# EAGLE board stm v0.3a (EAGLE 9.4.2)
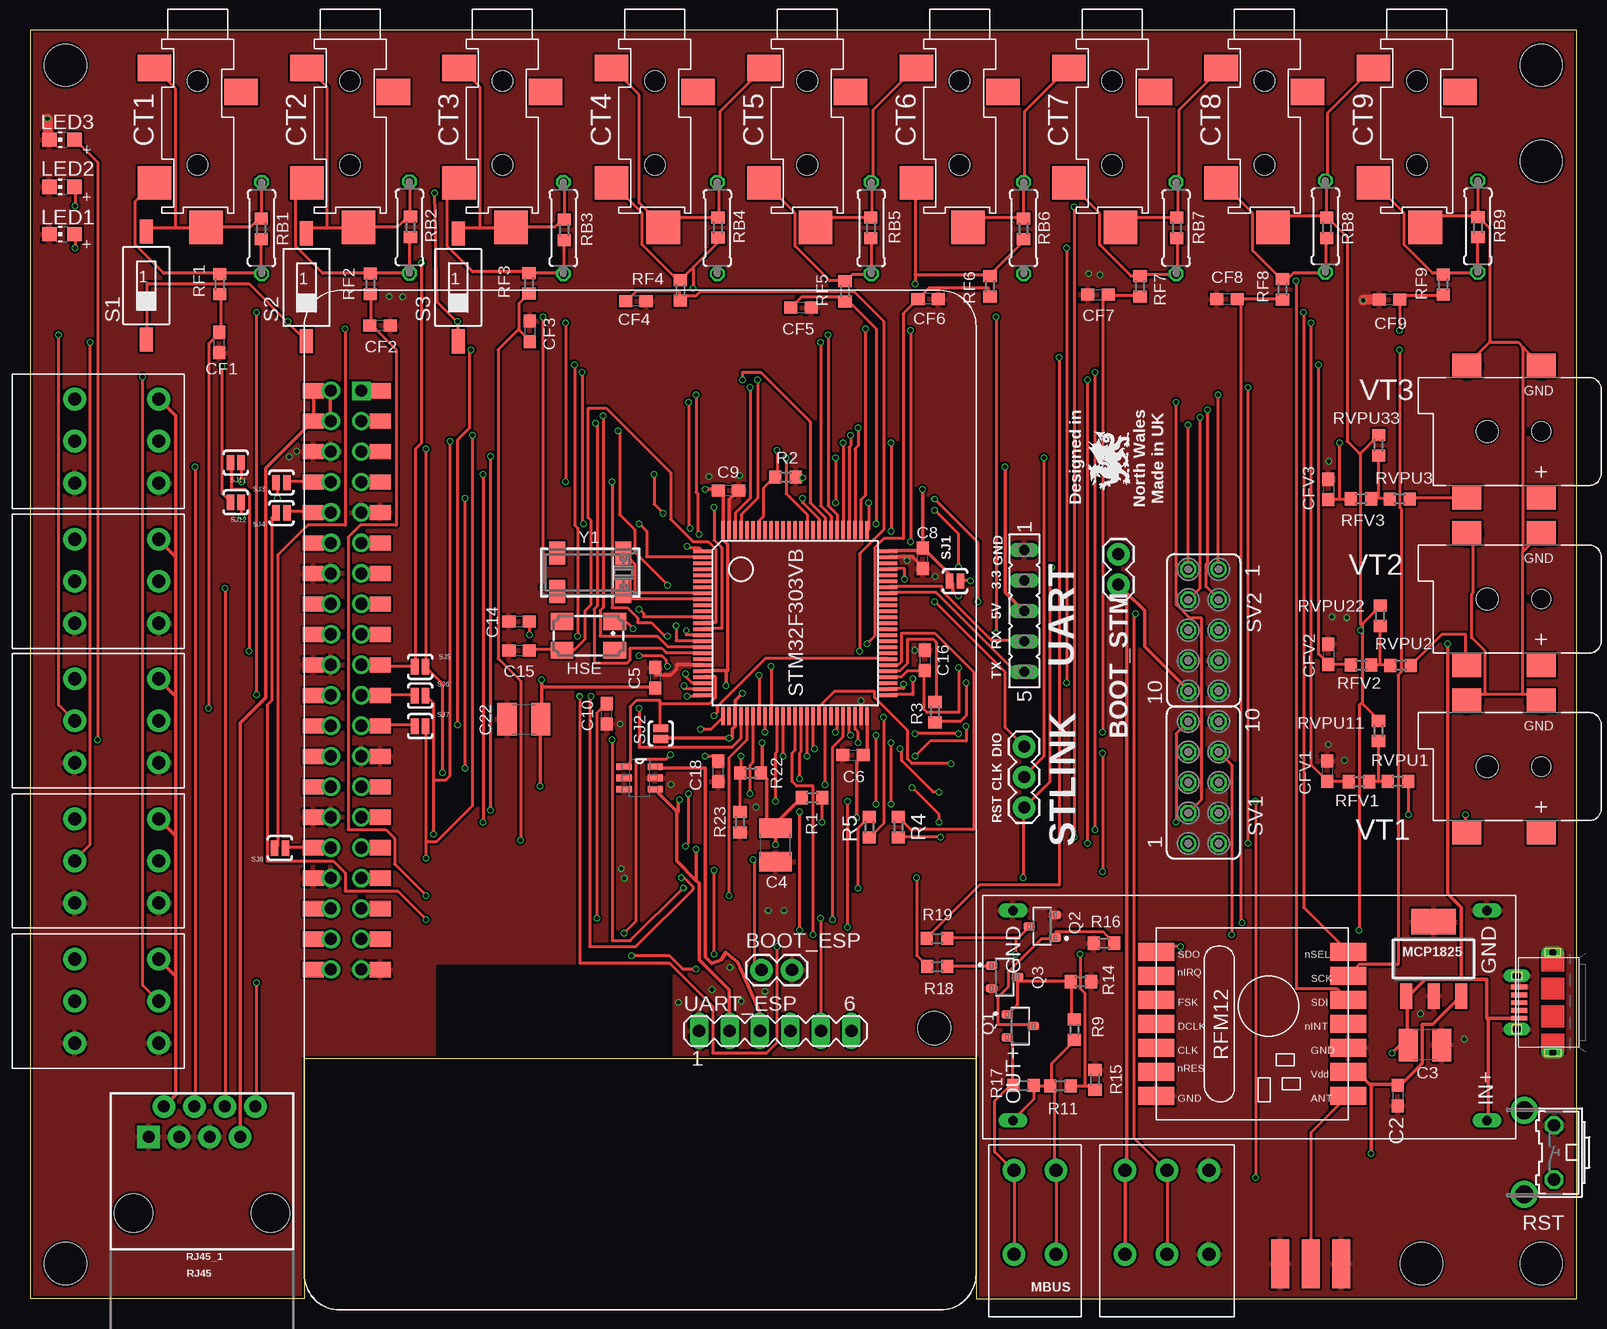
[diagram p2: board, top side]
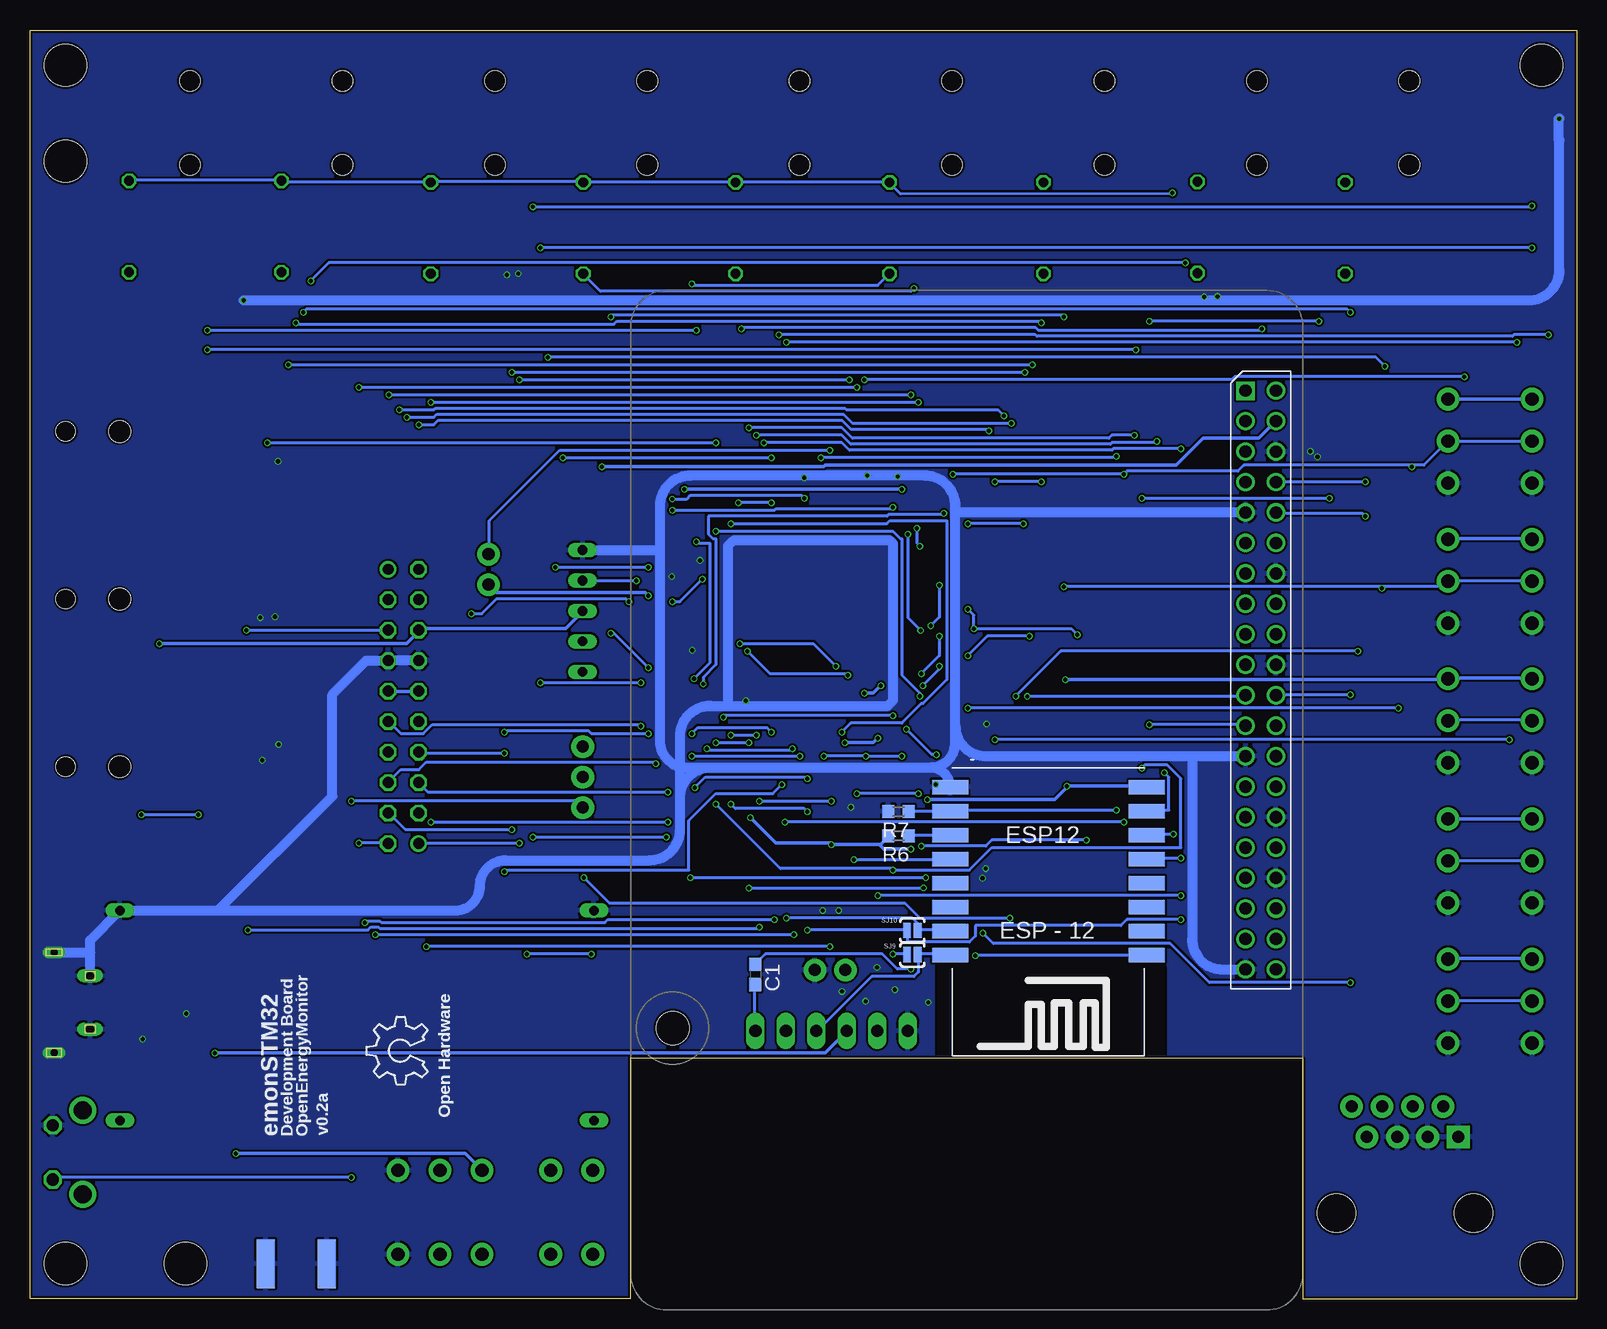
[diagram p3: board, bottom side, seen from below]

Size 128.91 x 105.79 mm. Coordinates in mm from the lower left corner, seen from the top.
Outline: 128.91,105.79 0,105.79 0,0 22.86,0 22.86,20.07 78.87,20.07 78.87,0 128.91,0 128.91,105.79
Copper layers (1*16): Top 0.035mm / dielectric 1.53mm / Bottom 0.035mm
Design rules "jlcpcb *": minimum track width 6mil, minimum drill 0.35mm, track to track 6mil, track to pad 6mil, pad to pad 7mil, via to via 8mil, smd to smd 0mil, copper to edge 8mil, drill to drill 10mil, minimum pad ring 3mil, minimum via ring 3mil, stop-mask expansion 2mil, vias tented up to drill 25mil, thermal gap 8mil
Net classes: 0 default: width 0.203 mm, drill 0.35 mm, clearance 0.152 mm; 1 power: width 0.279 mm, drill 0.35 mm, clearance 0.178 mm; 2 gnd: width 0.254 mm, drill 0.35 mm, clearance 0.152 mm
Holes 3.5 mm at 125.95,102.85 2.95,102.85 2.95,2.95 125.95,2.95 125.95,94.85 115.95,2.95
tRestrict: area 34,19.3 to 53.3,27.7
bRestrict: area 34.2,19.3 to 53.5,27.7

## Footprints (pad centres in the part's own frame; a part is rotated, then mirrored left to right if it is on the bottom)
OMNIMATE_LSF_2 = drill 1.1 pad 1.9: P$1 -3.5,-3.5; P$2 -3.5,3.5; P$3 0,-3.5; P$4 0,3.5
OMNIMATE_LSF_3 = drill 1.1 pad 1.9: P$1 -3.5,-3.5; P$2 -3.5,3.5; P$3 0,-3.5; P$4 0,3.5; P$5 3.5,-3.5; P$6 3.5,3.5
1X02 = drill 1.016 pad 1.88: 1 0,0; 2 2.54,0
C0603 = smd 1.1 x 1: 1 -0.85,0; 2 0.85,0
C1210 = smd 1.6 x 2.7: 1 -1.4,0; 2 1.4,0
STEREO_SMT = smd 2.8 x 2.2: P$1 -3.6,-2.4; P$3 3.6,-4.4 | smd 2.8 x 2.8: P$2 -3.6,-12; P$4 0.7,-15.7 | hole 1.7: 0,-3.5; 0,-10.5
ESP12-SMD = smd 3 x 1.2: ADC -8.3,3.8; CH_PD -8.3,1.8; GND 8.1,-8.2; GPIO0 8.1,-2.2; GPIO2 8.1,-4.2; GPIO4 8.1,-0.2; GPIO5 8.1,1.8; GPIO12 -8.3,-4.2; GPIO13 -8.3,-6.2; GPIO14 -8.3,-2.2; GPIO15 8.1,-6.2; GPIO16 -8.3,-0.2; RESET -8.3,5.8; RXD0 8.1,3.8; TXD0 8.1,5.8; VCC -8.3,-8.2
FE05-1 = drill 0.813 long: 1 -5.08,0; 2 -2.54,0; 3 0,0; 4 2.54,0; 5 5.08,0
CTS406 = smd 1.9 x 1.4: 1 -2.2,-1.2; 2 2.2,-1.2; 3 2.2,1.2; 4 -2.2,1.2
SMA-EDGE = smd 1.524 x 4.064: GND@0 0,0; GND@1 5.08,0; SIG 2.54,0 | smd 1.524 x 4.064 bottom: GND@2 0,0; GND@3 5.08,0
CHIP-LED0805 = smd 1.2 x 1.2: A 0,-1.05; C 0,1.05
SOT-223 = smd 1 x 2.1: 1 -2.3,-3.1; 2 0,-3.1; 3 2.3,-3.1 | smd 3.7 x 2.1: 4 0,3.1
RPI3MIRROR2 = drill 1.016 square: P$1 8.37,4.775 | drill 1.016: P$2 8.357,2.233; P$3 10.897,4.773; P$4 10.897,2.233; P$5 13.437,4.773; P$6 13.437,2.233; P$7 15.977,4.773; P$8 15.977,2.233; P$9 18.517,4.773; P$10 18.517,2.233; P$11 21.057,4.773; P$12 21.057,2.233; P$13 23.597,4.773; P$14 23.597,2.233; P$15 26.137,4.773; P$16 26.137,2.233; P$17 28.677,4.773; P$18 28.677,2.233; P$19 31.217,4.773; P$20 31.217,2.233; P$21 33.757,4.773; P$22 33.757,2.233; P$23 36.297,4.773; P$24 36.297,2.233; P$25 38.837,4.773; P$26 38.837,2.233; P$27 41.377,4.773; P$28 41.377,2.233; P$29 43.917,4.773; P$30 43.917,2.233; P$31 46.457,4.773; P$32 46.457,2.233; P$33 48.997,4.773; P$34 48.997,2.233; P$35 51.537,4.773; P$36 51.537,2.233; P$37 54.077,4.773; P$38 54.077,2.233; P$39 56.617,4.773; P$40 56.617,2.233 | smd 1.27 x 1.778: P$41 8.371,6.351; P$42 8.371,0.763; P$43 10.911,6.351; P$44 10.911,0.763; P$45 13.451,6.351; P$46 13.451,0.763; P$47 15.991,6.351; P$48 15.991,0.763; P$49 18.531,6.351; P$50 18.531,0.763; P$51 21.071,6.351; P$52 21.071,0.763; P$53 23.611,6.351; P$54 23.611,0.763; P$55 26.151,6.351; P$56 26.151,0.763; P$57 28.691,6.351; P$58 28.691,0.763; P$59 31.231,6.351; P$60 31.231,0.763; P$61 33.771,6.351; P$62 33.771,0.763; P$63 36.311,6.351; P$64 36.311,0.763; P$65 38.851,6.351; P$66 38.851,0.763; P$67 41.391,6.351; P$68 41.391,0.763; P$69 43.931,6.351; P$70 43.931,0.763; P$71 46.471,6.351; P$72 46.471,0.763; P$73 49.011,6.351; P$74 49.011,0.763; P$75 51.551,6.351; P$76 51.551,0.763; P$77 54.091,6.351; P$78 54.091,0.763; P$79 56.631,6.351; P$80 56.631,0.763 | hole 2.75: 61.5,52.505
SOT23 = smd 0.71 x 0.96: 1 -0.95,-1.075; 2 0.95,-1.075; 3 0,1.075
R0603 = smd 1 x 1.1: 1 -0.85,0; 2 0.85,0
0207/7 = drill 0.813 octagon: 1 -3.81,0; 2 3.81,0
RFM12 = smd 1.5 x 3: 1 -5,-10; 2 -3,-10; 3 -1,-10; 4 1,-10; 5 3,-10; 6 5,-10; 7 7,-10; 8 7,6; 9 5,6; 10 3,6; 11 1,6; 12 -1,6; 13 -3,6; 14 -5,6
RJ45-8 = drill 1 pad 1.88 square: 1 -4.445,6.35 | drill 1 pad 1.88: 2 -3.175,8.89; 3 -1.905,6.35; 4 -0.635,8.89; 5 0.635,6.35; 6 1.905,8.89; 7 3.175,6.35; 8 4.445,8.89 | hole 3.2: -5.715,0; 5.715,0
B3F-31XX = drill 1.016 octagon: 1 -2.261,-1.245; 2 2.261,-1.245 | drill 1.499 pad 2.159: 3 -3.505,1.245; 4 3.505,1.245
SMS-001 = smd 1.092 x 2.007: 1 0,-4.496; 2 0,4.496
SJ_2S-NO = smd 0.635 x 1.27: 1 -0.45,0; 2 0.45,0
1X03 = drill 1.016 pad 1.88: 1 0,0; 2 2.54,0; 3 5.08,0
TQFP100 = smd 0.27 x 1.5: 1 -6,-7.75; 2 -5.5,-7.75; 3 -5,-7.75; 4 -4.5,-7.75; 5 -4,-7.75; 6 -3.5,-7.75; 7 -3,-7.75; 8 -2.5,-7.75; 9 -2,-7.75; 10 -1.5,-7.75; 11 -1,-7.75; 12 -0.5,-7.75; 13 0,-7.75; 14 0.5,-7.75; 15 1,-7.75; 16 1.5,-7.75; 17 2,-7.75; 18 2.5,-7.75; 19 3,-7.75; 20 3.5,-7.75; 21 4,-7.75; 22 4.5,-7.75; 23 5,-7.75; 24 5.5,-7.75; 25 6,-7.75; 51 6,7.75; 52 5.5,7.75; 53 5,7.75; 54 4.5,7.75; 55 4,7.75; 56 3.5,7.75; 57 3,7.75; 58 2.5,7.75; 59 2,7.75; 60 1.5,7.75; 61 1,7.75; 62 0.5,7.75; 63 0,7.75; 64 -0.5,7.75; 65 -1,7.75; 66 -1.5,7.75; 67 -2,7.75; 68 -2.5,7.75; 69 -3,7.75; 70 -3.5,7.75; 71 -4,7.75; 72 -4.5,7.75; 73 -5,7.75; 74 -5.5,7.75; 75 -6,7.75 | smd 1.5 x 0.27: 26 7.75,-6; 27 7.75,-5.5; 28 7.75,-5; 29 7.75,-4.5; 30 7.75,-4; 31 7.75,-3.5; 32 7.75,-3; 33 7.75,-2.5; 34 7.75,-2; 35 7.75,-1.5; 36 7.75,-1; 37 7.75,-0.5; 38 7.75,0; 39 7.75,0.5; 40 7.75,1; 41 7.75,1.5; 42 7.75,2; 43 7.75,2.5; 44 7.75,3; 45 7.75,3.5; 46 7.75,4; 47 7.75,4.5; 48 7.75,5; 49 7.75,5.5; 50 7.75,6; 76 -7.75,6; 77 -7.75,5.5; 78 -7.75,5; 79 -7.75,4.5; 80 -7.75,4; 81 -7.75,3.5; 82 -7.75,3; 83 -7.75,2.5; 84 -7.75,2; 85 -7.75,1.5; 86 -7.75,1; 87 -7.75,0.5; 88 -7.75,0; 89 -7.75,-0.5; 90 -7.75,-1; 91 -7.75,-1.5; 92 -7.75,-2; 93 -7.75,-2.5; 94 -7.75,-3; 95 -7.75,-3.5; 96 -7.75,-4; 97 -7.75,-4.5; 98 -7.75,-5; 99 -7.75,-5.5; 100 -7.75,-6
FE05-2 = drill 0.914: 1 -5.08,1.27 | drill 0.914 octagon: 2 -5.08,-1.27; 3 -2.54,1.27; 4 -2.54,-1.27; 5 0,1.27; 6 0,-1.27; 7 2.54,1.27; 8 2.54,-1.27; 9 5.08,1.27; 10 5.08,-1.27
47589-0001 = smd 1.35 x 0.4: 1 2.8,1.3; 2 2.8,0.65; 3 2.8,0; 4 2.8,-0.65; 5 2.8,-1.3 | drill 0.6 pad 0.95 long: CASING1 0,4.175; CASING2 0,-4.175 | drill 0.7 pad 1.1 long: CASING3 3,2.225; CASING4 3,-2.225
BOOST = drill 0.8 long: IN+ 17.5,39.5; OUT+ 17.5,0; P$1 0,0; P$2 0,39.5
SOT95P280X145-6N = smd 1.27 x 0.559: 1 -1.295,0.94; 2 -1.295,0; 3 -1.295,-0.94; 4 1.295,-0.94; 5 1.295,0; 6 1.295,0.94
MA06-1 = drill 1.016 long: 1 -6.35,0; 2 -3.81,0; 3 -1.27,0; 4 1.27,0; 5 3.81,0; 6 6.35,0
DCJACK_2MM_SMT = smd 2.4 x 2: GND 0,-5.5; GNDBREAK 6.2,-5.5; PWR1 0,5.5; PWR2 6.2,5.5 | hole 1.6: 0,0 | hole 1.8: 4.5,0
CRYSTAL_8X3.8 = smd 1.3 x 1.9: P$1 -2.75,-1.6; P$2 2.75,-1.6; P$3 2.75,1.6; P$4 -2.75,1.6

## Placement (x,y rotation side)
2POLE_MBUS  OMNIMATE_LSF_2  [OMNIMATE_LSF_2]  85.5,7.24 0 top
3POLE_1  OMNIMATE_LSF_3  [OMNIMATE_LSF_3]  7.23,71.51 270 top
3POLE_2  OMNIMATE_LSF_3  [OMNIMATE_LSF_3]  7.23,59.83 270 top
3POLE_3  OMNIMATE_LSF_3  [OMNIMATE_LSF_3]  7.23,48.2 270 top
3POLE_4  OMNIMATE_LSF_3  [OMNIMATE_LSF_3]  7.23,36.52 270 top
3POLE_5  OMNIMATE_LSF_3  [OMNIMATE_LSF_3]  7.23,24.83 270 top
3POLE_6  OMNIMATE_LSF_3  [OMNIMATE_LSF_3]  94.74,7.24 0 top
BOOT_ESP  [1X02]  60.96,27.43 0 top
BOOT_STM  [1X02]  90.7,62.09 270 top
C1  100nF  [C0603]  68.45,27.05 270 bottom
C2  100nF  [C0603]  113.97,16.96 270 top
C3  4.7uF  [C1210]  116.25,21.17 180 top
C4  4.7uF  [C1210]  62.13,37.85 90 top
C5  100nF  [C0603]  52.09,51.79 270 top
C6  100nF  [C0603]  68.59,45.34 0 top
C8  100nF  [C0603]  74.39,61.75 90 top
C9  100nF  [C0603]  58.2,67.38 180 top
C10  100nF  [C0603]  48.08,48.78 90 top
C14  18pF  [C0603]  40.76,56.47 180 top
C15  18pF  [C0603]  40.76,54.04 180 top
C16  100nF  [C0603]  74.58,53.24 270 top
C18  10uF  [C0603]  57.36,43.98 90 top
C22  1uF  [C1210]  41.15,48.34 0 top
CF1  100nF  [C0603]  15.79,79.74 90 top
CF2  100nF  [C0603]  29.17,81.16 180 top
CF3  100nF  [C0603]  41.63,80.66 270 top
CF4  100nF  [C0603]  50.49,83.19 180 top
CF5  100nF  [C0603]  64.25,82.64 180 top
CF6  100nF  [C0603]  74.84,83.37 180 top
CF7  100nF  [C0603]  89,83.73 0 top
CF8  100nF  [C0603]  99.74,83.37 0 top
CF9  100nF  [C0603]  113.3,83.33 0 top
CFV1  100nF  [C0603]  108.1,44 270 top
CFV2  100nF  [C0603]  108.2,53.74 270 top
CFV3  100nF  [C0603]  108.2,67.49 270 top
CT1  STEREO_SMD  [STEREO_SMT]  13.97,105.04 0 top
CT2  STEREO_SMD  [STEREO_SMT]  26.67,105.04 0 top
CT3  STEREO_SMD  [STEREO_SMT]  39.37,105.04 0 top
CT4  STEREO_SMD  [STEREO_SMT]  52.07,105.04 0 top
CT5  STEREO_SMD  [STEREO_SMT]  64.77,105.04 0 top
CT6  STEREO_SMD  [STEREO_SMT]  77.47,105.04 0 top
CT7  STEREO_SMD  [STEREO_SMT]  90.17,105.04 0 top
CT8  STEREO_SMD  [STEREO_SMT]  102.87,105.04 0 top
CT9  STEREO_SMD  [STEREO_SMT]  115.57,105.04 0 top
ESP12  [ESP12-SMD]  44.13,34.47 180 bottom
GND  UART  [FE05-1]  82.86,57.36 270 top
HSE  8MHZ  [CTS406]  46.54,55.29 180 top
J$1  SMA_EDGE  [SMA-EDGE]  104.18,2.93 0 top
LED1  Red 1.85V  [CHIP-LED0805]  2.67,88.77 90 top
LED2  Red 1.85V  [CHIP-LED0805]  2.67,92.71 90 top
LED3  Red 1.85V  [CHIP-LED0805]  2.67,96.65 90 top
LOGO1  OSHW_LOGO_6MILX0200-NT  [OSHW_6X200_NOTEXT]  95.78,17.86 90 bottom
MCP1825  MCP1825SOT-223-3  [SOT-223]  116.97,28.35 0 top
PCB2  RPI3YA  [RPI3MIRROR2]  22.84,84.09 270 top
Q1  MMBT3906  [SOT23]  82.52,22.77 270 top
Q2  MMBT3904  [SOT23]  84.34,31.07 90 top
Q3  MMBT3904  [SOT23]  81.21,26.85 270 top
R1  4.7k  [R0603]  65.18,41.79 180 top
R2  10k  [R0603]  62.97,68.51 0 top
R3  220R  [R0603]  75.41,48.93 90 top
R4  220R  [R0603]  72.36,39.34 90 top
R5  220R  [R0603]  69.95,39.34 270 top
R6  10k  [R0603]  56.52,38.61 180 bottom
R7  10k  [R0603]  56.52,40.64 180 bottom
R9  39K  [R0603]  87.03,22.46 270 top
R11  33K  [R0603]  85.86,17.77 180 top
R14  22K  [R0603]  87.57,26.46 180 top
R15  3k3  [R0603]  88.75,18.27 270 top
R16  82R  [R0603]  89.51,29.66 0 top
R17  220K  [R0603]  82.79,17.81 0 top
R18  1K  [R0603]  75.6,27.72 180 top
R19  1K  [R0603]  75.6,30.06 180 top
R22  10k  [R0603]  60.06,43.85 0 top
R23  10k  [R0603]  59.16,39.76 90 top
RB1  22r  [R0603]  19.27,89.22 90 top
RB2  22r  [R0603]  31.71,89.37 90 top
RB3  22r  [R0603]  44.52,89.12 90 top
RB4  22r  [R0603]  57.33,89.31 90 top
RB5  22r  [R0603]  70.07,89.29 90 top
RB6  22r  [R0603]  82.78,89.22 90 top
RB7  22r  [R0603]  95.56,89.3 90 top
RB8  22r  [R0603]  108.07,89.31 90 top
RB9  22r  [R0603]  120.67,89.36 90 top
RB10  22r  [0207/7]  19.3,89.28 90 top
RB11  22r  [0207/7]  31.62,89.33 90 top
RB12  22r  [0207/7]  44.45,89.28 90 top
RB13  22r  [0207/7]  57.28,89.28 90 top
RB14  22r  [0207/7]  70.1,89.28 90 top
RB15  22r  [0207/7]  82.8,89.28 90 top
RB16  22r  [0207/7]  95.5,89.28 90 top
RB17  22r  [0207/7]  107.95,89.41 90 top
RB18  22r  [0207/7]  120.65,89.41 90 top
RF1  330R  [R0603]  15.81,84.6 270 top
RF2  330R  [R0603]  28.36,84.62 270 top
RF3  330R  [R0603]  41.59,84.66 270 top
RF4  330R  [R0603]  54.2,84.09 270 top
RF5  330R  [R0603]  67.92,84.01 270 top
RF6  330R  [R0603]  80,84.41 270 top
RF7  330R  [R0603]  92.5,84.43 270 top
RF8  330R  [R0603]  104.38,84.16 270 top
RF9  330R  [R0603]  117.77,84.56 270 top
RFM69HCW  RFM12_SMDSMD  [RFM12]  103.86,23.92 270 top
RFV1  330R  [R0603]  110.75,43.13 180 top
RFV2  330R  [R0603]  110.93,52.85 180 top
RFV3  330R  [R0603]  110.92,66.72 180 top
RJ45_1  RJ45  [RJ45-8]  14.33,7.17 0 top
RST  [B3F-31XX]  125.76,12.21 90 top
RVPU1  120k  [R0603]  114,43.15 0 top
RVPU2  120k  [R0603]  114.22,52.82 0 top
RVPU3  120k  [R0603]  114.15,66.7 180 top
RVPU11  10k  [R0603]  112.38,47.36 90 top
RVPU22  10k  [R0603]  112.52,56.96 90 top
RVPU33  10k  [R0603]  112.39,71.18 90 top
S1  SWS001  [SMS-001]  9.69,84.49 180 top
S2  SWS001  [SMS-001]  23.04,84.34 180 top
S3  SWS001  [SMS-001]  35.69,84.33 180 top
SJ1  SOLDERJUMPERNO  [SJ_2S-NO]  77.09,59.85 180 top
SJ2  SOLDERJUMPERNO  [SJ_2S-NO]  52.56,47.13 90 top
SJ3  SOLDERJUMPERNO  [SJ_2S-NO]  20.95,68.07 180 top
SJ4  SOLDERJUMPERNO  [SJ_2S-NO]  20.95,65.53 180 top
SJ5  SOLDERJUMPERNO  [SJ_2S-NO]  32.51,52.7 180 top
SJ6  SOLDERJUMPERNO  [SJ_2S-NO]  32.51,50.29 180 top
SJ7  SOLDERJUMPERNO  [SJ_2S-NO]  32.51,47.75 180 top
SJ8  SOLDERJUMPERNO  [SJ_2S-NO]  20.83,37.59 180 top
SJ9  SOLDERJUMPERNO  [SJ_2S-NO]  55.37,28.7 0 bottom
SJ10  SOLDERJUMPERNO  [SJ_2S-NO]  55.37,30.73 180 bottom
SJ11  SOLDERJUMPERNO  [SJ_2S-NO]  17.14,69.72 180 top
SJ12  SOLDERJUMPERNO  [SJ_2S-NO]  17.14,66.42 180 top
STLINK  [1X03]  82.84,46.06 270 top
STM32F303VB  STM32F303XB  [TQFP100]  63.75,56.34 270 top
SV1  [FE05-2]  97.79,43.05 90 top
SV2  [FE05-2]  97.79,55.75 270 top
U$1  MICRO-USB-RECEPTACLE47589-0001  [47589-0001]  126.89,24.71 180 top
U$2  BOOST_MODULE  [BOOST]  81.92,32.38 270 top
U$8  MCP1501T-33E  [SOT95P280X145-6N]  50.8,43.43 0 top
UART_ESP  [MA06-1]  62.1,22.35 0 top
VT1  2.1MMJACKSMT  [DCJACK_2MM_SMT]  125.94,44.38 180 top
VT2  2.1MMJACKSMT  [DCJACK_2MM_SMT]  125.94,58.35 180 top
VT3  2.1MMJACKSMT  [DCJACK_2MM_SMT]  125.94,72.32 180 top
Y1  32.768kHz  [CRYSTAL_8X3.8]  46.69,60.58 180 top

## Tracks (layer width: path | path; a pad name or v marks a point on that pad's centre or on a via)
24V
  Top 0.254: R11.2 85,17.75 83.75,17.75 R17.2 83.62,17.75 83.62,16.62 82,15 U$2.OUT+ | R9.2 87,21.5 85.12,19.62 85.12,17.88 R11.2 | 2POLE_MBUS.P$3 85.5,10.62 2POLE_MBUS.P$4 85.38,10.75 85.38,17.75 85.25,17.88 R11.2
+3V3  (via drill 0.35)
  Top 0.279: 111.75,17.88 111.62,17.88 110.62,18.88 109.88,18.88 RFM69HCW.9 | 111.75,17.88 113.88,17.88 C2.1 114,17.88 114.25,17.88 116,19.62 116,22.88 116.88,22.88 119.25,25.25 MCP1825.3 | 3POLE_6.P$1 91.25,10.62 3POLE_6.P$2 91.38,10.75 91.38,58.75 91.44,58.81 | C8.2 74.5,62.5 76.62,60.38 76.62,59.88 SJ1.2 76.75,59.75 76.88,59.62 76.88,59 77.25,58.62 v77.38,58.62 | STM32F303VB.75 71.62,62.38 74.38,62.38 74.38,62.5 C8.2 | 91.44,58.81 90.75,59.5 BOOT_STM.2 | 91.44,58.81 92.88,57.38 92.88,54.38 96.5,50.75 SV2.10 | v111.75,12.12 111.75,17.88 | 12.12,26.88 12.12,17 11.25,16.12 RJ45_1.2 | 12.12,26.88 10.75,28.25 3POLE_5.P$2 | 12.06,38.69 12.12,38.62 12.12,26.88 | 12.06,38.69 10.75,40 3POLE_4.P$2 | 12.06,50.31 12.12,50.25 12.12,38.75 12.06,38.69 | 12.06,50.31 10.75,51.62 3POLE_3.P$2 | 12.06,61.94 12.12,61.88 12.12,50.38 12.06,50.31 | 12.06,61.94 10.75,63.25 3POLE_2.P$2 | 3POLE_1.P$2 10.75,75 12.12,73.62 12.12,62 12.06,61.94 | 58,52.38 58.12,52.38 58.12,62.88 57.75,63.25 57.75,64 STM32F303VB.100 57.75,64.12 57.75,67 57.38,67.38 C9.2 57.25,67.5 v56.25,67.5 | 58,52.38 56.12,52.38 STM32F303VB.21 | SJ2.1 52.62,46.75 v58.25,46.75 58.5,46.75 58.5,47.5 58.75,47.75 58.75,48.5 STM32F303VB.28 58.75,48.62 58.75,49.88 v59.38,50.5 | STM32F303VB.50 69.75,48.5 69.75,45.62 69.5,45.38 C6.2 69.38,45.25 68.88,44.75 v68.88,40.12 | v62.12,37.88 C4.2 | C4.2 62,39.25 61.38,39.88 61.38,43.38 61,43.75 R22.2 61,43.88 v61,46.38 | R1.2 64.25,41.75 62.25,39.75 62.25,39.38 C4.2 | v58,51.12 58,52.38 | 42.62,51 52,51 C5.2 | 42.62,51 42.62,48.38 C22.2 42.5,48.25 v42.5,42.75 | 53.88,40.62 52.12,42.38 U$8.4 | 53.88,40.62 53.88,36.5 55.44,34.94
  Top 0.279: 55.44,34.94 55.75,34.62 55.75,28.25 58.25,25.75 58.25,22.38 UART_ESP.2 | v54.12,41.62 54,41.5 54,40.62 53.88,40.62 | v55.5,37.5 55.5,35 55.44,34.94 | 42.62,51 v42.62,51.62 | v74.38,67.5 74.38,62.62 C8.2
  Bottom 0.279: SV2.10 96.62,50.62 99,50.62 SV2.9 | v77.38,58.62 77.62,58.88 90,58.88 90.62,59.5 BOOT_STM.2 | v111.75,12.12 92.62,12.12 3POLE_6.P$2 | 3POLE_1.P$1 3.75,75 10.62,75 3POLE_1.P$2 | 3POLE_2.P$1 3.75,63.38 10.62,63.38 3POLE_2.P$2 | 3POLE_3.P$1 3.75,51.75 10.62,51.75 3POLE_3.P$2 10.75,51.62 v42.62,51.62 | 3POLE_4.P$1 3.75,40 10.62,40 3POLE_4.P$2 | 3POLE_5.P$1 3.75,28.38 10.62,28.38 3POLE_5.P$2 | 58,37.88 57.38,38.5 R6.2 | 58,37.88 v62.12,37.88 62.12,38 66.75,38 v68.88,40.12 | v58.25,46.75 58.62,46.38 v61,46.38 | v58,51.12 58.62,50.5 v59.38,50.5 | ESP12.VCC 35.88,42.75 v42.5,42.75 42.5,42.62 43.5,41.62 v54.12,41.62 | v55.5,37.5 57.75,37.5 58,37.75 58,37.88 | v56.25,67.5 v74.38,67.5
+3V3_ADC
  Top 0.254: 52.5,49.62 52.5,47.62 SJ2.2 | 52.5,49.62 52.5,49.88 50.5,49.88 50,49.38 50,44.75 49.62,44.38 U$8.1 | 52.5,49.62 56.62,49.62 57.12,50.12 57.12,51.88 56.12,51.88 STM32F303VB.22
+5V  (via drill 0.35)
  Top 0.279: PCB2.P$4 25,73.25 25,75.5 PCB2.P$2 25,75.62 23.75,75.62 PCB2.P$42 23.62,75.62 23.62,73.25 PCB2.P$44 23.5,73.12 19.62,69.25 19.62,50.12 17.5,48 17.5,13.62 RJ45_1.7 | U$8.6 52.12,44.25 56.25,44.25 56.25,28.5 56.81,27.96 57.6,28.26 57.98,28.9 58.97,28.06 60.75,24 60.75,22.38 UART_ESP.3 | 121.5,23.38 124,23.38 U$1.1 | 121.5,23.38 121.5,15 U$2.IN+ | 119.25,26.62 121.38,26.62 121.38,23.38 121.5,23.38 | 119.25,26.62 116.25,26.62 114.88,25.25 MCP1825.1 114.75,25.25 114.75,21.25 C3.2 114.62,21.25 114.25,21.25 v113.5,20.5 | v118.12,54.62 118.12,33.75 119.25,32.62 119.25,26.62 | v81.25,69.38 81.25,58.88 82.75,57.38 GND.3
  Bottom 0.279: GND.3 82.88,57.25 84.25,55.88 96.5,55.88 SV2.6 96.5,55.62 97.5,54.62 v118.12,54.62 | v113.5,20.5 62.62,20.5 60.88,22.25 UART_ESP.3 | v81.25,69.38 62.75,69.38 62.62,69.5 33.38,69.5 31.12,71.75 26.5,71.75 25.12,73.12 PCB2.P$4
AC1  (via drill 0.35)
  Top 0.254: v114.88,40.38 114.88,43.12 RVPU1.2 | v119.62,40.38 119.62,39 VT1.PWR2
  Bottom 0.254: v119.62,40.38 v114.88,40.38
AC2
  Top 0.254: RVPU2.2 115.12,52.88 117.62,55.38 119.62,55.38 119.62,52.88 VT2.PWR2
AC3
  Top 0.254: RVPU3.1 115,66.75 119.62,66.75 VT3.PWR2
ADC0
  Top 0.254: 112.38,66.75 111.88,66.75 RFV3.1 | 112.38,66.75 113.25,66.75 RVPU3.2 | 112.38,66.75 112.38,70.25 RVPU33.1
ADC_RJ45IN  (via drill 0.35)
  Top 0.254: v55.88,47.5 56.75,47.5 57.75,48.5 STM32F303VB.26 | v53.38,45.38 53,45 50.5,45 50.5,31.5 v49.5,30.5 | v18.88,26.38 18.88,16.12 RJ45_1.8
  Bottom 0.254: v55.88,47.5 53.75,45.38 v53.38,45.38 | v49.5,30.5 48.62,29.62 33.88,29.62 30.62,26.38 v18.88,26.38
ANT
  Top 0.254: RFM69HCW.8 109.75,16.88 106.75,13.88 106.75,3 J$1.SIG
BIAS  (via drill 0.35)
  Top 0.254: 111,49.62 112.38,48.25 RVPU11.2 | 111,56.25 111,55.75 | 111,55.75 111,49.62 | 111,56.25 112.5,57.75 RVPU22.2 | 110.88,70.5 112.38,72 RVPU33.2 | 110.88,70.5 110.88,56.25 111,56.25 | v62.12,41.5 62.12,45.5 62.25,45.62 62.25,48.5 STM32F303VB.35 | v68.12,31 v68.12,41.5 | v110.75,30.75 110.75,49.5 110.88,49.62 111,49.62 | v110.88,55.75 111,55.75 | 124.38,50.38 125.88,50.38 125.88,50 VT1.GND | 124.38,50.38 121.25,50.38 | 121.25,50.38 120.12,50.38 119.75,50 VT1.GNDBREAK | 121.25,50.38 121.25,54 120.12,55.12 120.12,58.75 120.25,58.88 120.25,63.25 119.75,63.75 VT2.GNDBREAK | 124.44,62.31 124.38,62.25 124.38,50.38 | 124.44,62.31 125.88,63.75 VT2.GND | RB9.2 120.62,90.25 120.62,93.12 RB18.2 | 121.62,79.75 119.75,77.88 VT3.GNDBREAK | 121.62,79.75 121.62,89.25 120.75,90.12 RB9.2 | 124.44,79.31 124,79.75 121.62,79.75 | 124.44,79.31 125.88,77.88 VT3.GND | CT9.P$4 116.38,89.38 117.25,90.25 120.5,90.25 RB9.2 | 124.44,62.31 124.38,62.38 124.38,79.25 124.44,79.31 | CT7.P$4 90.88,89.38 91.62,90.12 95.5,90.12 RB7.2 95.62,90.25 95.62,93 RB16.2 95.75,93 95.75,99.12 99.25,102.62 CT8.P$1 | RB8.2 108,90.25 108,93.12 RB17.2 108.12,93.12 108.12,98.88 111.88,102.62 CT9.P$1 | CT8.P$4 103.62,89.38 104.5,90.25 107.88,90.25 RB8.2 | 21.44,81.44 18.25,84.62 9.75,84.62 9.75,80 S1.2 | 21.44,81.44 23,79.88 S2.2 | S3.2 35.62,79.88 v35.62,81.5 35.5,81.5 33.88,83.12 v33.71,92.2 | v21.5,81.5 21.44,81.44 | CT4.P$1 48.5,102.62 50.75,100.38 50.75,91.38 52.75,89.38 CT4.P$4 52.88,89.38 53.62,90.12 57.25,90.12 RB4.2 57.38,90.25 57.38,93 RB13.2 57.5,93 57.5,99 61.12,102.62 CT5.P$1 | CT5.P$4 65.5,89.38 66.25,90.12 70,90.12 RB5.2 70.12,90.25 70.12,93 RB14.2 70.25,93 70.25,99.12 73.75,102.62 CT6.P$1
  Top 0.254: CT6.P$4 78.25,89.38 79,90.12 82.62,90.12 RB6.2 82.75,90.12 82.75,93 RB15.2 82.88,93.12 82.88,99 86.5,102.62 CT7.P$1 | 110.88,70.5 110.75,70.5 109.75,71.5 109.75,88.5 108.12,90.12 RB8.2
  Bottom 0.254: v68.12,41.5 v62.12,41.5 | v68.12,31 68.25,30.88 99.75,30.88 99.88,31 100.5,31 100.75,30.75 v110.75,30.75 | v110.88,55.75 99.12,55.75 SV2.5 | v21.5,81.5 v35.62,81.5 | v33.71,92.2 56.38,92.12 57.25,93 RB13.2 57.38,93.12 70,93.12 RB14.2 70.12,93.12 82.75,93.12 RB15.2 82.88,93.12 95.5,93.12 RB16.2 95.62,93.12 107.88,93.12 RB17.2 108,93.25 120.62,93.25 RB18.2
BIAS_IN  (via drill 0.35)
  Top 0.254: R23.2 59.12,40.62 59.12,43.75 R22.1 59.25,43.88 v59.25,45.25 | v56.25,45.25 56.88,45.25 57.25,44.88 C18.2 | v62.75,45.25 62.75,48.5 STM32F303VB.36
  Bottom 0.254: v56.25,45.25 v59.25,45.25 v62.75,45.25
BIAS_SW1
  Top 0.254: RB10.2 19.25,93 19.25,90.12 RB1.2 19.12,90.12 18.38,89.38 14.75,89.38 CT1.P$4 14.62,89.25 12.12,89.25 | 12.12,89.25 10,89.25 9.75,89 S1.1 | 12.12,89.25 12.12,100.88 10.38,102.62 CT1.P$1
BIAS_SW2
  Top 0.254: RB11.2 31.62,93.12 31.62,90.25 RB2.2 31.5,90.25 30.62,89.38 27.38,89.38 CT2.P$4 27.25,89.25 24.75,89.25 | 24.75,89.25 23.5,89.25 23.12,88.88 S2.1 | 24.75,89.25 24.75,101 23.12,102.62 CT2.P$1
BIAS_SW3
  Top 0.254: RB12.2 44.5,93 44.5,90 RB3.2 44.38,90 43.75,89.38 40.12,89.38 CT3.P$4 40,89.25 37.5,89.25 | 37.5,89.25 36.12,89.25 35.75,88.88 S3.1 | 37.5,89.25 37.5,101 35.88,102.62 CT3.P$1
BOOT0  (via drill 0.35)
  Top 0.254: STM32F303VB.94 60.75,64.12 60.75,64.88 61.12,65.25 61.12,67.62 62,68.5 R2.1 62.25,68.5 v62.25,70.75
  Bottom 0.254: v62.25,70.75 84.75,70.75 90.62,64.88 90.62,62.12 BOOT_STM.1
CS_RFM69  (via drill 0.35)
  Top 0.254: PCB2.P$62 23.62,50.38 25,50.38 PCB2.P$22 | v106.12,82.25 106.12,32.62 109.75,29 RFM69HCW.14 | v18.88,50.38 v18.88,82.25
  Bottom 0.254: v106.12,82.25 105.88,82.5 19.12,82.5 v18.88,82.25 | v18.88,50.38 25,50.38 PCB2.P$22
CT1  (via drill 0.35)
  Top 0.254: RF1.2 15.88,83.75 15.88,80.62 CF1.2 15.75,80.5 14.88,79.62 v14.88,49.25 | v50.75,49.25 50.75,46 58.5,46 59.25,46.75 59.25,48.5 STM32F303VB.29
  Bottom 0.254: v14.88,49.25 v50.75,49.25
CT2  (via drill 0.35)
  Top 0.254: RF2.2 28.38,83.75 28.38,81.25 CF2.2 28.5,81.25 28.5,81.12 30.5,79.12 30.5,64.5 27.5,64.5 26.5,63.5 26.5,39.12 29.62,39.12 30.38,38.38 30.38,36.25 v33,33.62 | v58.25,33.62 58.25,45.12 59.75,46.62 59.75,48.5 STM32F303VB.30
  Bottom 0.254: v33,33.62 v58.25,33.62
CT3  (via drill 0.35)
  Top 0.254: 40.75,80.75 40.75,83 41.5,83.75 RF3.2 | 40.75,80.75 41.62,79.88 CF3.2 | v60,42.12 60,44.5 60.25,44.75 60.25,48.5 STM32F303VB.31 | v54.88,42.12 54.88,38 v54.62,37.75 | v40.88,38.25 40.88,51.5 39,53.38 39,79.12 40.62,80.75 40.75,80.75
  Bottom 0.254: v54.88,42.12 v60,42.12 | v54.62,37.75 49.25,37.75 48.75,38.25 v40.88,38.25
CT4  (via drill 0.35)
  Top 0.254: CF4.2 49.75,83.25 50.5,84 54.12,84 54.12,83.25 RF4.2 54.25,83.62 55.5,83.62 55.88,84 68.62,84 71.12,81.5 71.12,64.12 69.12,62.12 v69.12,54 | v60.75,52 60.75,48.62 STM32F303VB.32
  Bottom 0.254: v60.75,52 60.88,52.12 67.25,52.12 v69.12,54
CT5  (via drill 0.35)
  Top 0.254: CF5.2 63.5,82.75 64.25,83.5 67.88,83.5 67.88,83.25 RF5.2 68,83.38 70.5,80.88 v70.5,64.62 | v61.25,47.25 61.25,48.5 STM32F303VB.33
  Bottom 0.254: v61.25,47.25 60.5,48 56.25,48 54.62,49.62 54.5,49.62 52.5,51.62 52.5,64.88 57.25,64.88 57.5,64.62 v70.5,64.62
CT6  (via drill 0.35)
  Top 0.254: RF6.2 79.88,83.62 79.88,84.25 74.88,84.25 CF6.2 73.88,83.25 72.75,82.12 72.75,63.38 71.12,63.38 70.38,62.62 70.38,55.25 v69.75,54.62 | v61.75,52.75 61.75,48.62 STM32F303VB.34
  Bottom 0.254: v61.75,52.75 63.62,54.62 v69.75,54.62
CT7  (via drill 0.35)
  Top 0.254: RF7.2 92.5,83.62 89.88,83.62 CF7.2 89.75,83.62 89.38,83.25 v89.38,47.25 | v67.12,47.25 67.25,47.38 67.25,48.5 STM32F303VB.45 | v77.38,47.12 v73.75,47.12
  Bottom 0.254: v67.12,47.25 67.5,47.62 73.25,47.62 v73.75,47.12 | v77.38,47.12 82.12,47.12 82.38,47.38 89.25,47.38 v89.38,47.25
CT8  (via drill 0.35)
  Top 0.254: RF8.2 104.38,83.38 100.62,83.38 CF8.2 100.88,83.25 100.88,31.5 v101,31.38 | v66.88,31.62 66.88,46 67.75,46.88 67.75,48.5 STM32F303VB.46
  Bottom 0.254: v66.88,31.62 80.75,31.62 81,31.38 99.62,31.38 99.75,31.5 100.88,31.5 v101,31.38
CT9  (via drill 0.35)
  Top 0.254: RF9.2 117.75,83.62 114.5,83.62 114.25,83.38 CF9.2 114.12,83.25 v114.12,80.75 | v73.57,51.71 73.57,50.38 71.62,50.38 STM32F303VB.51 | v73.38,80.75 v73.38,63.12
  Bottom 0.254: v73.57,51.71 72.25,53.03 72.25,63 73.25,63 v73.38,63.12 | v114.12,80.75 v73.38,80.75
DS18B20  (via drill 0.35)
  Top 0.254: v66,39.75 66,41.75 R1.1 | v37.75,68.75 v37.75,39.75 | v72.8,51.27 72.8,50.88 71.62,50.88 STM32F303VB.52 | v52.75,65.5 52,66.25 v52,68.75 | v13.75,69.38 13.75,16.12 RJ45_1.4
  Bottom 0.254: v37.75,39.75 v66,39.75 | 13.75,69.5 12.75,69.5 10.75,71.5 3POLE_1.P$4 10.62,71.5 3.75,71.5 3POLE_1.P$3 | 13.75,69.5 27.75,69.5 28.25,69 37.5,69 v37.75,68.75 v52,68.75 | v72.8,51.27 72.8,51.83 71.75,52.88 71.75,63.38 72,63.38 72.38,63.75 72.38,65.25 57.5,65.25 57.38,65.38 52.88,65.38 v52.75,65.5 | v13.75,69.38 13.75,69.5
GND  (via drill 0.35)
  Top 0.279: STM32F303VB.20 56,52.88 53.88,52.88 53.88,52.5 53.38,52 52.12,52 52.12,52.62 C5.1 | v69.25,49.88 69.25,48.62 STM32F303VB.49 | STM32F303VB.74 71.62,61.88 73.5,61.88 74.38,61 C8.1 | STM32F303VB.99 58.25,64.12 58.25,66.62 59,67.38 C9.1 | v64.39,68.45 R2.2
  Top 0.813: CF9.1 111.18,83.33 arc90 v111.1,83.26 | v1.46,98.4 1.46,96.8 arc90 LED3.C
  Bottom 0.279: v69.25,49.88 69.25,49.46
  Bottom 0.813: U$1.CASING4 123.89,28.86 | 123.89,28.86 123.89,29.91 U$2.P$2 113.24,32.38 | 113.24,32.38 103.72,41.91 103.72,50.39 100.89,53.21 SV2.7 SV2.8 | 70.74,49.97 70.74,62.78 70.3,63.22 57.23,63.22 56.98,62.97 56.98,49.9 57.42,49.46 69.25,49.46 72.2,49.46 arc-90 74.74,46.92 74.74,41.77 | 113.24,32.38 93.46,32.38 arc-90 91.41,34.44 arc90 89.27,36.58 77.28,36.58 arc-90 74.74,39.12 74.74,41.77 | 74.74,41.77 arc90 72.2,44.31 | ESP12.GND arc-90 53.87,44.31 | 72.2,44.31 53.87,44.31 | 53.87,44.31 arc-90 51.79,46.39 51.79,47.79 | 76.42,62.43 76.42,66.1 arc90 73.88,68.64 54.33,68.64 arc90 51.79,66.1 51.79,65.56 | 76.42,62.43 76.42,46.53 arc-90 74.2,44.31 72.2,44.31 | 51.79,47.79 51.79,65.56 | 51.79,47.79 arc-90 49.25,45.25 32.07,45.25 | 32.07,45.25 PCB2.P$25 | PCB2.P$9 51.77,65.57 arc-90 51.79,65.56 | 32.07,45.25 32.07,30.01 arc-90 29.53,27.47 PCB2.P$39 | v111.1,83.26 3.99,83.26 arc-90 1.45,85.8 1.45,96.57 arc-90 1.53,96.65 1.53,98.33 arc90 v1.46,98.4 | GND.1 76.44,62.44 arc90 76.42,62.43 | U$1.CASING2 123.92,28.89 arc90 123.89,28.86
  other vias: 60.5,41 108.23,69.84 61.51,32.39 62.84,32.38 61.24,25.63 56.83,25.79 54.05,24.73 58.32,27.65 59.27,24.82 53.42,42.9 49.19,47.94 115.88,23.8 119.52,21.67 73.08,61.57 75.43,60.24 56.59,68.56 59.14,68.64 73.72,54.08 108.19,46.22 109.54,44.91 49.53,35.09 49.26,35.89 108.49,56.87 109.73,56.8 88.22,85.47 89.16,85.37 21.61,70.2 22.21,70.67 29.94,83.57 31.05,83.55
  pour Top (isolate 0.178): 139.22,-7.21 -8.73,-7.21 -8.73,108.6 139.22,108.6
  pour Bottom: -12.17,110.63 -12.17,-9.99 141.99,-9.99 141.99,110.63
HSE_IN  (via drill 0.35)
  Top 0.254: v41.62,55.38 41.62,56.38 C14.1 | v50.25,55.88 49.75,56.38 48.75,56.38 HSE.1 | v50.75,57.5 51.12,57.12 51.12,56.88 56,56.88 STM32F303VB.12
  Bottom 0.254: v41.62,55.38 42.12,55.88 v50.25,55.88 50.25,57 v50.75,57.5
HSE_OUT
  Top 0.254: C15.1 41.62,54.12 44.25,54.12 HSE.3 44.38,54.12 45.38,54.12 46.25,55 46.25,57.38 46.75,57.88 46.75,64.88 46.5,65.12 46.5,74.25 48,74.25 53.38,68.88 53.38,65 55.25,63.12 56.5,63.12 57.12,62.5 57.12,56.38 56.12,56.38 STM32F303VB.13
LED1
  Top 0.254: R3.2 75.5,49.88 75.5,54.75 75.25,55 73.12,55 73.12,53 72.5,52.38 71.62,52.38 STM32F303VB.55
LED2
  Top 0.254: R4.2 72.38,40.12 73.38,39.12 78.62,39.12 78.62,52.25 75.38,55.5 72.62,55.5 72.62,53.12 72.38,52.88 71.62,52.88 STM32F303VB.56
LED3  (via drill 0.35)
  Top 0.254: v71.12,48.5 71.12,39.62 70,38.5 R5.2 | v57,48.62 57.25,48.88 57.25,49.38 61.25,53.38 71.5,53.38 STM32F303VB.57
  Bottom 0.254: v71.12,48.5 71,48.62 v57,48.62
MBUS_RX  (via drill 0.35)
  Top 0.254: v73.88,35.12 73.88,28.62 74.75,27.75 R18.2 | v54.26,35.13 54.47,35.13 55.25,34.36 55.25,34.13 50.49,29.38 46.62,29.38 46.62,50.12 v46.75,50.25 | v18.25,54 18.25,67.12 17.88,67.5 16.75,67.5 16.75,69.62 SJ11.2
  Bottom 0.254: v54.26,35.13 73.87,35.13 v73.88,35.12 | v46.75,50.25 43,54 v18.25,54
MBUS_TX  (via drill 0.35)
  Top 0.254: v85.75,78.5 85.75,34.5 79.12,34.5 74.75,30.12 R19.2 | v16,77.75 16,67.12 16.62,66.5 SJ12.2
  Bottom 0.254: v85.75,78.5 16.75,78.5 v16,77.75
MISO  (via drill 0.35)
  Top 0.254: SJ6.2 32,50.38 29.25,50.38 PCB2.P$61 29.12,50.38 27.62,50.38 PCB2.P$21 | v95.88,29.38 94.25,29.38 93.88,29 RFM69HCW.1 | v62.25,29.38 62.25,21.38 61.38,20.5 56.88,20.5 56.88,24.38 53.25,28 45.8,28 v45.8,50.24
  Bottom 0.254: v62.25,29.38 v95.88,29.38 | v45.8,50.24 27.63,50.24 PCB2.P$21
MOSI  (via drill 0.35)
  Top 0.254: PCB2.P$19 27.62,52.88 29.12,52.88 PCB2.P$59 29.25,52.75 32,52.75 SJ5.2 32.12,52.75 32.12,70.88 32.62,71.38 v32.62,86.38 | v105.5,84.88 105.5,25.88 108.88,25.88 109.75,25 RFM69HCW.12
  Bottom 0.254: v105.5,84.88 104,86.38 v32.62,86.38
N$1  (via drill 0.35)
  Top 0.254: v78.38,59.88 77.62,59.88 SJ1.1
  Bottom 0.254: v78.38,59.88 82.75,59.88 GND.2
N$2
  Top 0.254: RB1.1 19.25,88.25 19.25,85.62 RB10.1 19.25,85.5 15.88,85.5 RF1.1 15.75,85.5 11.12,85.5 8.75,87.88 8.75,91.5 10.25,93 CT1.P$2
N$5  (via drill 0.35)
  Top 0.254: v75.88,38.5 72.38,38.5 R4.1 | v87,91.05 v87,38.5 | v3.75,91.12 3.75,92.62 LED2.A
  Bottom 0.254: v87,38.5 v75.88,38.5 | v3.75,91.12 3.82,91.05 v87,91.05
N$6  (via drill 0.35)
  Top 0.254: v69,34.25 69,39.25 69.88,40.12 R5.1 | v54.45,34.27 50.02,29.88 48.5,29.88 v48.5,46.62 | v5.62,46.62 5.62,94.75 3.75,96.62 LED3.A
  Bottom 0.254: v69,34.25 68.98,34.27 v54.45,34.27 | v5.62,46.62 v48.5,46.62
N$7  (via drill 0.35)
  Top 0.254: v60.25,36.62 60.38,36.5 60.38,28 60.88,27.5 BOOT_ESP.1
  Bottom 0.254: v60.25,36.62 52.25,36.62 ESP12.GPIO0
N$8
  Top 0.254: RB2.1 31.62,88.5 31.62,85.62 RB11.1 31.5,85.5 28.38,85.5 RF2.1 28.25,85.5 24.38,85.5 22.12,87.75 22.12,92.12 23,93 CT2.P$2
N$10
  Top 0.254: RB3.1 44.5,88.25 44.5,85.5 RB12.1 44.38,85.5 41.62,85.5 RF3.1 41.5,85.62 36.88,85.62 34.75,87.75 34.75,92 35.75,93 CT3.P$2
N$11
  Bottom 0.254: R6.1 55.62,38.62 52.25,38.62 ESP12.GPIO2
N$16
  Top 0.254: SJ8.1 21.38,37.62 23.5,37.62 PCB2.P$72 23.62,37.62 25,37.62 PCB2.P$32
N$22
  Top 0.254: PCB2.P$41 29.12,75.75 27.62,75.75 PCB2.P$1
N$24
  Top 0.254: PCB2.P$57 29.12,55.5 27.62,55.5 PCB2.P$17
N$29
  Top 0.254: Q1.2 81.5,21.75 81.88,21.38 81.88,17.88 R17.1 81.75,17.88 80.38,16.5 80.38,12.25 81.88,10.75 2POLE_MBUS.P$2 82,10.62 2POLE_MBUS.P$1
N$30
  Top 0.254: Q1.3 83.5,22.88 80.62,22.88 80.62,25.12 81.5,26 81.5,27.25 84.25,30 85.38,30 Q2.1 85.5,30.12 85.5,30.62 89.38,30.62 90.25,29.75 R16.2
N$31
  Top 0.254: R9.1 87,23.38 86.75,23.62 86.75,26.38 R14.2 86.62,26.5 82.38,26.5 Q3.3 82.25,26.75 82.25,24.5 81.5,23.75 Q1.1
N$32  (via drill 0.35)
  Top 0.254: 87.88,17.75 86.75,17.75 R11.1 | 87.88,17.75 88.5,17.75 88.75,17.5 R15.2 | 82.12,30.12 76.5,30.12 R19.1 | 82.12,30.12 82.38,30.12 83.25,31 Q2.3 | 87.88,17.75 87.88,25.5 87.5,25.88 v87.5,28.75 | 82.12,30.12 v82.12,28.75
  Bottom 0.254: v82.12,28.75 v87.5,28.75
N$33
  Top 0.254: Q3.1 80.12,27.75 76.5,27.75 R18.1
N$34
  Top 0.254: 112.5,52.88 111.88,52.88 RFV2.1 | 112.5,52.88 113.25,52.88 RVPU2.1 | 112.5,52.88 112.5,56 RVPU22.1
N$37
  Top 0.254: 112.38,43.12 113.12,43.12 RVPU1.1 | 112.38,43.12 111.62,43.12 RFV1.1 | 112.38,43.12 RVPU11.1
N$38  (via drill 0.35)
  Top 0.254: 55.19,85.94 57.25,88 57.25,88.38 RB4.1 | 55.19,85.94 54.25,85 RF4.1 54.12,85 53.88,85 51,87.88 51,90.5 48.5,93 CT4.P$2 | v55.25,84.25 55.25,85.88 55.19,85.94
  Bottom 0.254: v55.25,84.25 55.5,84 81.38,84 82.75,85.38 RB15.1
N$39
  Top 0.254: RB5.1 70.12,88.38 70.12,85.5 RB14.1 70,85.38 68.5,85.38 68,84.88 RF5.1 67.88,84.88 66.62,84.88 63.75,87.75 63.75,90.5 61.25,93 CT5.P$2
N$40  (via drill 0.35)
  Top 0.254: RB6.1 82.75,88.25 82.75,88.12 80,85.38 RF6.1 79.88,85.38 73.75,85.38 | 73.75,85.38 73.75,93 CT6.P$2 | 73.75,85.38 v73.75,84.62
  Bottom 0.254: v73.75,84.62 73.62,84.5 58.25,84.5 57.38,85.38 RB13.1
N$41  (via drill 0.35)
  Top 0.254: v78,51.38 78,48.62 77.5,48.12 75.5,48.12 R3.1 | v86.38,87.62 v86.38,51.38 | v3.75,87.62 3.75,88.75 LED1.A
  Bottom 0.254: v86.38,51.38 v78,51.38 | v3.75,87.62 v86.38,87.62
N$42
  Top 0.254: RB7.1 95.62,88.38 95.62,85.5 RB16.1 95.5,85.38 92.62,85.38 RF7.1 92.38,85.25 91.75,85.25 89.12,87.88 89.12,90.5 86.62,93 CT7.P$2
N$43
  Top 0.254: RB8.1 108,88.38 108,85.62 RB17.1 107.88,85.5 105.25,85.5 104.88,85.12 104.5,85.12 RF8.1 104.25,85 101.88,87.38 101.88,90.5 99.38,93 CT8.P$2
N$44
  Top 0.254: RB9.1 120.62,88.5 120.62,85.62 RB18.1 120.62,85.5 117.88,85.5 RF9.1 117.75,85.5 116.88,85.5 114.5,87.88 114.5,90.5 112,93 CT9.P$2
NRST  (via drill 0.35)
  Top 0.254: v47.25,31.75 47.25,48.88 48,49.62 C10.2 | v82.75,35.12 82.75,40.88 STLINK.3 82.88,41 85,43.12 85,60.88 v85.12,61 | v57,66 57,63.25 57.62,62.62 57.62,55.88 56.12,55.88 STM32F303VB.14 | v75.38,65.75 77.38,63.75 v77.38,61 | v102.12,41.5 v102.12,10.12
  Bottom 0.254: v47.25,31.75 54.75,31.75 56,33 80.62,33 v82.75,35.12 | v57,66 57.12,65.88 66.75,65.88 66.88,65.75 v75.38,65.75 | v85.12,61 v77.38,61 | v102.12,10.12 126.88,10.12 127,10 RST.1 | v102.12,41.5 83.38,41.5 82.88,41 STLINK.3
PC0  (via drill 0.35)
  Top 0.254: v54.69,55.73 54.69,55.38 56,55.38 STM32F303VB.15 | v55.75,63.75 55.62,63.88 55.62,67.12 55.5,67.25 v55.5,75.38 | v99,75.38 99,60.88 SV2.1
  Bottom 0.254: v54.69,55.73 55.75,56.79 v55.75,63.75 | v99,75.38 v55.5,75.38
PC1  (via drill 0.35)
  Top 0.254: v53.84,56.13 53.84,54.88 56,54.88 STM32F303VB.16 | v53.12,59.5 50.38,62.25 50.38,64.12 49.12,65.38 49.12,72.25 v49,72.38 | v96.5,72.88 96.5,60.88 SV2.2
  Bottom 0.254: v53.84,56.13 53.12,56.85 v53.12,59.5 | v49,72.38 49.12,72.5 60.5,72.5 61.25,73.25 94.88,73.25 95.25,72.88 v96.5,72.88
PC2  (via drill 0.35)
  Top 0.254: v47.75,73.62 47.75,57.62 47.5,57.38 47.5,55.25 52.25,55.25 53.12,54.38 56,54.38 STM32F303VB.17 | v98.12,74.12 98.12,61.38 98,61.25 98,59.38 99,58.38 SV2.3
  Bottom 0.254: v47.75,73.62 48.25,74.12 60.88,74.12 61,74.25 95.12,74.25 95.25,74.12 v98.12,74.12
PC3  (via drill 0.35)
  Top 0.254: v47.12,73 47.25,72.88 47.25,57.75 47,57.5 47,53 49.75,53 50,53.25 50,54.25 52.62,54.25 53,53.88 56,53.88 STM32F303VB.18 | v97.5,73.5 97.5,59.25 96.62,58.38 SV2.4
  Bottom 0.254: v47.12,73 60.38,73 61.12,73.75 95,73.75 95.25,73.5 v97.5,73.5
PC14
  Top 0.254: STM32F303VB.8 56,58.88 50.38,58.88 50.38,61.25 49.5,62.12 Y1.P$1
PC15
  Top 0.254: STM32F303VB.9 56,58.38 49.5,58.38 49.5,58.88 Y1.P$4
PE0  (via drill 0.35)
  Top 0.254: v60.62,76.62 60.62,66.75 59.25,65.38 59.25,64.12 STM32F303VB.97 | v88.12,38 v88.12,76.62
  Bottom 0.254: v88.12,76.62 v60.62,76.62 | v88.12,38 96.5,38 SV1.1
PE1  (via drill 0.35)
  Top 0.254: v60,76 60,66.75 58.75,65.5 58.75,64.12 STM32F303VB.98 | v101.5,38 v101.5,76
  Bottom 0.254: v101.5,76 v60,76 | v101.5,38 99.12,38 SV1.2
PE2  (via drill 0.35)
  Top 0.254: v54.75,62.75 54.75,62.62 55.75,62.62 56,62.38 STM32F303VB.1 | v55,64.25 54.88,64.38 v54.88,74.75 | v95.5,74.75 95.5,57.88 96.62,56.75 97.62,56.75 97.62,41.62 96.62,40.62 SV1.3
  Bottom 0.254: v54.75,62.75 55,63 v55,64.25 | v95.5,74.75 v54.88,74.75
PE3  (via drill 0.35)
  Top 0.254: v50.75,64.62 51.38,64 51.38,61.88 56,61.88 STM32F303VB.2 | v46.12,64.62 46,64.75 v46,77.25 | v88.75,39.12 v88.75,77.25
  Bottom 0.254: v46.12,64.62 v50.75,64.62 | v88.75,77.25 v46,77.25 | v88.75,39.12 97.62,39.12 99,40.5 SV1.4
PE7  (via drill 0.35)
  Top 0.254: v65.25,30.38 65.25,42.75 63.88,42.75 63.5,43.12 63.5,45.5 63.75,45.75 63.75,48.5 STM32F303VB.38 | v100.12,30.38 100.12,44.5 99.12,45.5 SV1.8
  Bottom 0.254: v100.12,30.38 v65.25,30.38
PE8  (via drill 0.35)
  Top 0.254: v64.12,43.38 64.12,45.5 64.25,45.62 64.25,48.5 STM32F303VB.39 | v73.5,42.62 75.75,40.38 v75.75,39.75 | v95.5,39.75 95.5,47.12 96.5,48.12 SV1.9
  Bottom 0.254: v64.12,43.38 64.25,43.5 72.62,43.5 v73.5,42.62 | v95.5,39.75 v75.75,39.75
PE9  (via drill 0.35)
  Top 0.254: v64.75,45.25 64.75,48.5 STM32F303VB.40 | v73.75,45.25 75,46.5 78,46.5 v78,47.75
  Bottom 0.254: v73.75,45.25 v64.75,45.25 | v78,47.75 78.12,47.88 95.38,47.88 96.12,47.12 98,47.12 99,48.12 SV1.10
PE10  (via drill 0.35)
  Top 0.254: v65.38,45.88 65.25,46 65.25,48.5 STM32F303VB.41 | v72.5,45.88 72.62,45.75 72.62,44.88 75.25,42.25 v75.75,42.25
  Bottom 0.254: v65.38,45.88 65.5,45.75 72.38,45.75 v72.5,45.88 | v75.75,42.25 95.75,42.25 96.5,43 SV1.5
PE11  (via drill 0.35)
  Top 0.254: v76.75,44.62 73.5,44.62 73.12,45 73.12,47.38 70.38,50.12 70.38,50.62 67,50.62 65.75,49.38 65.75,48.62 STM32F303VB.42
  Bottom 0.254: v76.75,44.62 76.88,44.75 95.88,44.75 96.5,44.12 98,44.12 99,43.12 SV1.6
PE12  (via drill 0.35)
  Top 0.254: v66.25,42.88 66.25,48.5 STM32F303VB.43 | v89.38,45.5 v89.38,35.62
  Bottom 0.254: v66.25,42.88 67,42.12 71.75,42.12 74,39.88 74,35.75 89.25,35.75 v89.38,35.62 | v89.38,45.5 96.5,45.5 SV1.7
PULSE  (via drill 0.35)
  Top 0.254: STM32F303VB.54 71.62,51.88 72.62,51.88 73.12,52.38 74.5,52.38 C16.2 74.5,52.25 74.5,49.12 74.75,48.88 77.38,48.88 v77.38,52.62 | v80.5,81.88 v80.5,55.5 | v42.75,59.38 v42.75,81.88 | v16.25,59.25 16.25,16.12 RJ45_1.6
  Bottom 0.254: v77.38,52.62 80.25,55.5 v80.5,55.5 | v80.5,81.88 80.38,82 42.88,82 v42.75,81.88 | 16.25,59.38 11.12,59.38 10.75,59.75 3POLE_2.P$4 10.62,59.88 3.75,59.88 3POLE_2.P$3 | 16.25,59.38 v42.75,59.38 | v16.25,59.25 16.25,59.38
PUSHIN_3  (via drill 0.35)
  Top 0.254: v66.5,80.38 66.5,66.12 67.25,65.38 67.25,64.12 STM32F303VB.81 | v2.38,80.38 2.38,49.5 3.62,48.25 3POLE_3.P$3
  Bottom 0.254: v66.5,80.38 45.12,80.38 45,80.25 5.38,80.25 5.25,80.38 v2.38,80.38 | 3POLE_3.P$4 10.62,48.25 3.75,48.25 3POLE_3.P$3
PUSHIN_4  (via drill 0.35)
  Top 0.254: v65.88,79.75 65.88,66.12 66.75,65.25 66.75,64.12 STM32F303VB.82 | v5,79.75 5,37.88 3.75,36.62 3POLE_4.P$3
  Bottom 0.254: v5,79.75 v65.88,79.75 | 3POLE_4.P$4 10.62,36.5 3.75,36.5 3POLE_4.P$3
PUSHIN_5  (via drill 0.35)
  Top 0.254: v59.38,76.62 59.38,77.25 60.88,77.25 65,73.12 65,66.38 66.25,65.12 66.25,64.12 STM32F303VB.83 | v9.38,76.88 9.38,26.12 10.62,24.88 3POLE_5.P$4
  Bottom 0.254: v59.38,76.62 28.75,76.62 28.5,76.88 v9.38,76.88 | 3POLE_5.P$3 3.75,24.88 10.62,24.88 3POLE_5.P$4
PUSHIN_6  (via drill 0.35)
  Top 0.254: v64.38,66.75 64.38,66.38 65.75,65 65.75,64.12 STM32F303VB.84 | v75.39,66.68 79,63.06 v79,58.12 | v92.12,57.12 92,57 92,13.38 94.62,10.75 3POLE_6.P$4 94.75,10.62 3POLE_6.P$3
  Bottom 0.254: v64.38,66.75 64.62,67 73.88,67 74.2,66.68 v75.39,66.68 | v79,58.12 79.25,58.38 90,58.38 91.25,57.12 v92.12,57.12
RST_ESP_1
  Bottom 0.254: C1.2 68.5,26.12 68.5,22.38 UART_ESP.6
RST_ESP_2  (via drill 0.35)
  Top 0.254: v55.5,27.5 54.38,27.5 53.25,28.62 v50.12,28.62
  Bottom 0.254: v55.5,27.5 56.62,27.5 57.88,28.75 67.62,28.75 68.38,28 C1.1 | v50.12,28.62 35.88,28.62 ESP12.RESET
RXD0  (via drill 0.35)
  Top 0.254: SJ4.1 21.5,65.62 23.5,65.62 PCB2.P$50 23.62,65.62 25,65.62 PCB2.P$10 | v17.62,65.25 17.62,66.38 SJ12.1
  Bottom 0.254: v17.62,65.25 17.88,65.5 25,65.5 PCB2.P$10
SPI3_CLK  (via drill 0.35)
  Top 0.254: v33,36.75 33,38.12 | 33,38.12 33,47.75 SJ7.1 | v69,72.62 69,71.12 68.75,70.88 68.75,64.12 STM32F303VB.78 | v36.88,72 36.88,41.12 33.88,38.12 33,38.12
  Bottom 0.254: v33,36.75 35.75,36.75 ESP12.GPIO14 | v69,72.62 61.25,72.62 60.38,71.75 39,71.75 38.75,72 v36.88,72
SPI3_CS  (via drill 0.35)
  Top 0.254: v26.25,80.88 26.25,64.5 23.12,64.5 20.62,62 20.62,37.75 20.5,37.62 SJ8.2 | v69.62,80.88 69.62,67 69.25,66.62 69.25,64.12 STM32F303VB.77
  Bottom 0.254: v26.25,80.88 26.38,80.75 44.88,80.75 45.12,81 69.5,81 v69.62,80.88
SPI3_CS_ESP  (via drill 0.35)
  Top 0.254: v63,70.12 63,67.12 64.75,65.38 64.75,64.12 STM32F303VB.86 | v38.38,40.75 v38.38,70.25
  Bottom 0.254: R7.1 55.62,40.62 52.25,40.62 ESP12.GPIO15 52.12,40.75 v38.38,40.75 | v63,70.12 38.5,70.12 v38.38,70.25
SPI3_MISO  (via drill 0.35)
  Top 0.254: v33.62,38.75 33.62,43.25 | 33.62,43.25 33.62,49.62 33,50.25 SJ6.1 | v68.38,72 68.38,71.12 68.25,71 68.25,64.12 STM32F303VB.79 | v35,71.5 35,43.62 34.62,43.25 33.62,43.25
  Bottom 0.254: v33.62,38.75 35.75,38.75 ESP12.GPIO12 | v68.38,72 61.25,72 60.5,71.25 38.88,71.25 38.75,71.38 35.12,71.38 v35,71.5
SPI3_MOSI  (via drill 0.35)
  Top 0.254: v34.38,43.88 34.38,51.25 33,52.62 SJ5.1 33,52.75 v33,70.88 | v67.75,71.38 67.75,64.12 STM32F303VB.80
  Bottom 0.254: v34.38,43.88 34,43.5 34,40.75 35.75,40.75 ESP12.GPIO13 | v67.75,71.38 61.25,71.38 60.62,70.75 38.75,70.75 38.62,70.88 v33,70.88
SPI_CLK  (via drill 0.35)
  Top 0.254: SJ7.2 32,47.88 29.25,47.88 PCB2.P$63 29.12,47.88 27.62,47.88 PCB2.P$23 | v114.12,79.12 114.12,66 114.25,65.88 114.25,52.25 114,52 114,27.88 110.75,27.88 109.88,27 RFM69HCW.13 | v36.75,79.12 36.62,79 36.62,72.62 35.62,71.62 v35.62,47.88
  Bottom 0.254: v36.75,79.12 v114.12,79.12 | v35.62,47.88 27.62,47.88 PCB2.P$23
SWCLK  (via drill 0.35)
  Top 0.254: v69.88,66.38 69.88,64.12 STM32F303VB.76 | v67.12,70.12 v67.12,66.38 | v84.5,70.12 84.5,45.25 82.88,43.62 STLINK.2
  Bottom 0.254: v67.12,66.38 v69.88,66.38 | v84.5,70.12 v67.12,70.12
SWDIO  (via drill 0.35)
  Top 0.254: v72.88,60 72.88,60.88 71.62,60.88 STM32F303VB.72 | v75.38,58.12 81.25,52.25 81.25,47.62 82.75,46.12 STLINK.1
  Bottom 0.254: v72.88,60 74.75,58.12 v75.38,58.12
TXD0  (via drill 0.35)
  Top 0.254: SJ3.1 21.5,68.12 23.5,68.12 PCB2.P$48 23.62,68.12 25,68.12 PCB2.P$8 | v17.62,68.12 17.62,69.62 SJ11.1
  Bottom 0.254: v17.62,68.12 25,68.12 PCB2.P$8
UART_RX
  Top 0.254: STM32F303VB.69 71.62,59.38 76,59.38 76,59 80.12,54.88 82.75,54.88 GND.4
UART_RX_ESP
  Bottom 0.254: ESP12.TXD0 52.25,28.75 54.88,28.75 SJ9.2 54.88,28.62 54.88,27.25 55.25,26.88 58.75,26.88 63.25,22.38 UART_ESP.4
UART_TX
  Top 0.254: STM32F303VB.68 71.62,58.88 75.5,58.88 82,52.38 82.75,52.38 GND.5
UART_TX_ESP  (via drill 0.35)
  Top 0.254: v65.88,31.75 65.88,22.38 UART_ESP.5
  Bottom 0.254: ESP12.RXD0 52.25,30.75 54.88,30.75 SJ10.1 54.88,30.88 54.88,31.25 55.38,31.75 v65.88,31.75
USART3_RX  (via drill 0.35)
  Top 0.254: v20.62,66.75 20.62,68 SJ3.2 | v36.25,44.25 v36.25,66.75 | v57,28.75 v57,35.75 | v69,46.38 69,47.25 68.75,47.5 68.75,48.5 STM32F303VB.48 | v71.75,41.25 v71.75,46.38
  Bottom 0.254: v36.25,66.75 v20.62,66.75 | v36.25,44.25 36,44.5 34.12,44.5 33,43.38 33,37.62 48.75,37.62 50.62,35.75 v57,35.75 57,35.88 66.38,35.88 v71.75,41.25 | v57,28.75 55.88,28.75 SJ9.1 | v71.75,46.38 v69,46.38
USART3_TX  (via drill 0.35)
  Top 0.254: v33,31.62 30.62,34 26.25,34 26.25,35.5 25.25,36.5 19.75,36.5 19.75,49.5 20.12,49.88 20.12,65.12 20.5,65.5 SJ4.2 | v68.38,47 68.25,47.12 68.25,48.5 STM32F303VB.47 | v70.5,41.25 v70.5,47 | v64.12,30.75 v64.12,40.62
  Bottom 0.254: v33,31.62 37.5,31.62 38,31.12 50.12,31.12 50.12,30.25 50.62,29.75 55.75,29.75 55.75,30.62 SJ10.2 55.88,30.75 v64.12,30.75 | v70.5,47 v68.38,47 | v70.5,41.25 70.12,40.88 64.38,40.88 v64.12,40.62
VSIG1  (via drill 0.35)
  Top 0.254: RFV1.2 109.88,43.12 108.12,43.12 CFV1.2 108,43.25 106.75,44.5 v106.75,81.38 | v54.62,52.12 54.62,51.88 55.12,51.38 56,51.38 STM32F303VB.23 | v53.12,55.25 52.88,55.25 51.75,56.38 50.62,56.38 50.62,56.75 49.75,57.62 48.5,57.62 v48.5,68.12 | v44.62,81.38 v44.62,68.12
  Bottom 0.254: v54.62,52.12 53.12,53.62 v53.12,55.25 | v44.62,68.12 v48.5,68.12 | v44.62,81.38 44.75,81.5 80,81.5 80.25,81.25 106.62,81.25 v106.75,81.38
VSIG2  (via drill 0.35)
  Top 0.254: RFV2.2 110,52.88 108.25,52.88 CFV2.2 108.12,53 107.38,53.75 v107.38,77.88 | v54.5,51.12 54.5,50.88 56,50.88 STM32F303VB.24 | v53.12,52.75 53,52.88 53,53.25 52.62,53.62 v50.75,53.62 | v45.62,55.25 45.62,64.25 45.38,64.5 v45.38,77.88
  Bottom 0.254: v54.5,51.12 53.12,52.5 v53.12,52.75 | v50.75,53.62 49.12,55.25 v45.62,55.25 | v107.38,77.88 v45.38,77.88
VSIG3  (via drill 0.35)
  Top 0.254: 109.12,66.62 110,66.62 RFV3.2 | 109.12,66.62 108.25,66.62 CFV3.2 | v54.75,50.25 56,50.25 STM32F303VB.25 | v71.75,71.38 v71.75,64 | 109.12,66.62 v109.12,71.38
  Bottom 0.254: v54.75,50.25 54.75,50.5 56.25,52 56.25,63.38 56.38,63.38 57,64 v71.75,64 | v109.12,71.38 v71.75,71.38

## Text on the board
tPlace: Designed in | North Wales | Made in UK
bPlace: Open Hardware
tNames: VT3 | SJ1 | VT2 | UART | 3.3 | 5V | RX | TX | DIO | CLK | RST | VT1 | MBUS
bNames: v0.2a | OpenEnergyMonitor | Development Board | emonSTM32
tDocu: 128.905 x / 105.791 y